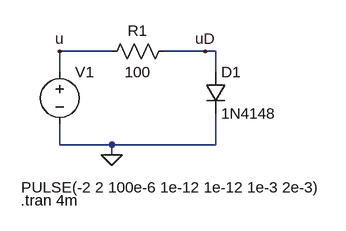
[diagram p0: schematic 104_lec_diode_schaltverhalten.asc]
104_lec_diode_schaltverhalten.asc, the LTspice schematic file:
Version 4
SHEET 1 880 680
WIRE 96 80 16 80
WIRE 240 80 176 80
WIRE 256 80 240 80
WIRE 16 112 16 80
WIRE 256 112 256 80
WIRE 16 224 16 192
WIRE 96 224 16 224
WIRE 256 224 256 176
WIRE 256 224 96 224
WIRE 96 240 96 224
FLAG 96 240 0
FLAG 16 80 u
FLAG 240 80 uD
SYMBOL diode 240 112 R0
SYMATTR InstName D1
SYMATTR Value 1N4148
SYMBOL res 192 64 R90
WINDOW 0 0 56 VBottom 2
WINDOW 3 32 56 VTop 2
SYMATTR InstName R1
SYMATTR Value 100
SYMBOL voltage 16 96 R0
WINDOW 3 -59 194 Left 2
WINDOW 123 0 0 Left 0
WINDOW 39 0 0 Left 0
SYMATTR InstName V1
SYMATTR Value PULSE(-2 2 100e-6 1e-12 1e-12 1e-3 2e-3)
TEXT -44 310 Left 2 !.tran 4m

The netlist it stands for:
* 104_lec_diode_schaltverhalten.asc
D1 uD 0 1N4148
R1 uD u 100
V1 u 0 PULSE(-2 2 100e-6 1e-12 1e-12 1e-3 2e-3)
.model D D
.lib standard.dio
.tran 4m
.backanno
.end